# EAGLE design openSX70-dongle_v4-push (EAGLE 9.2.0)
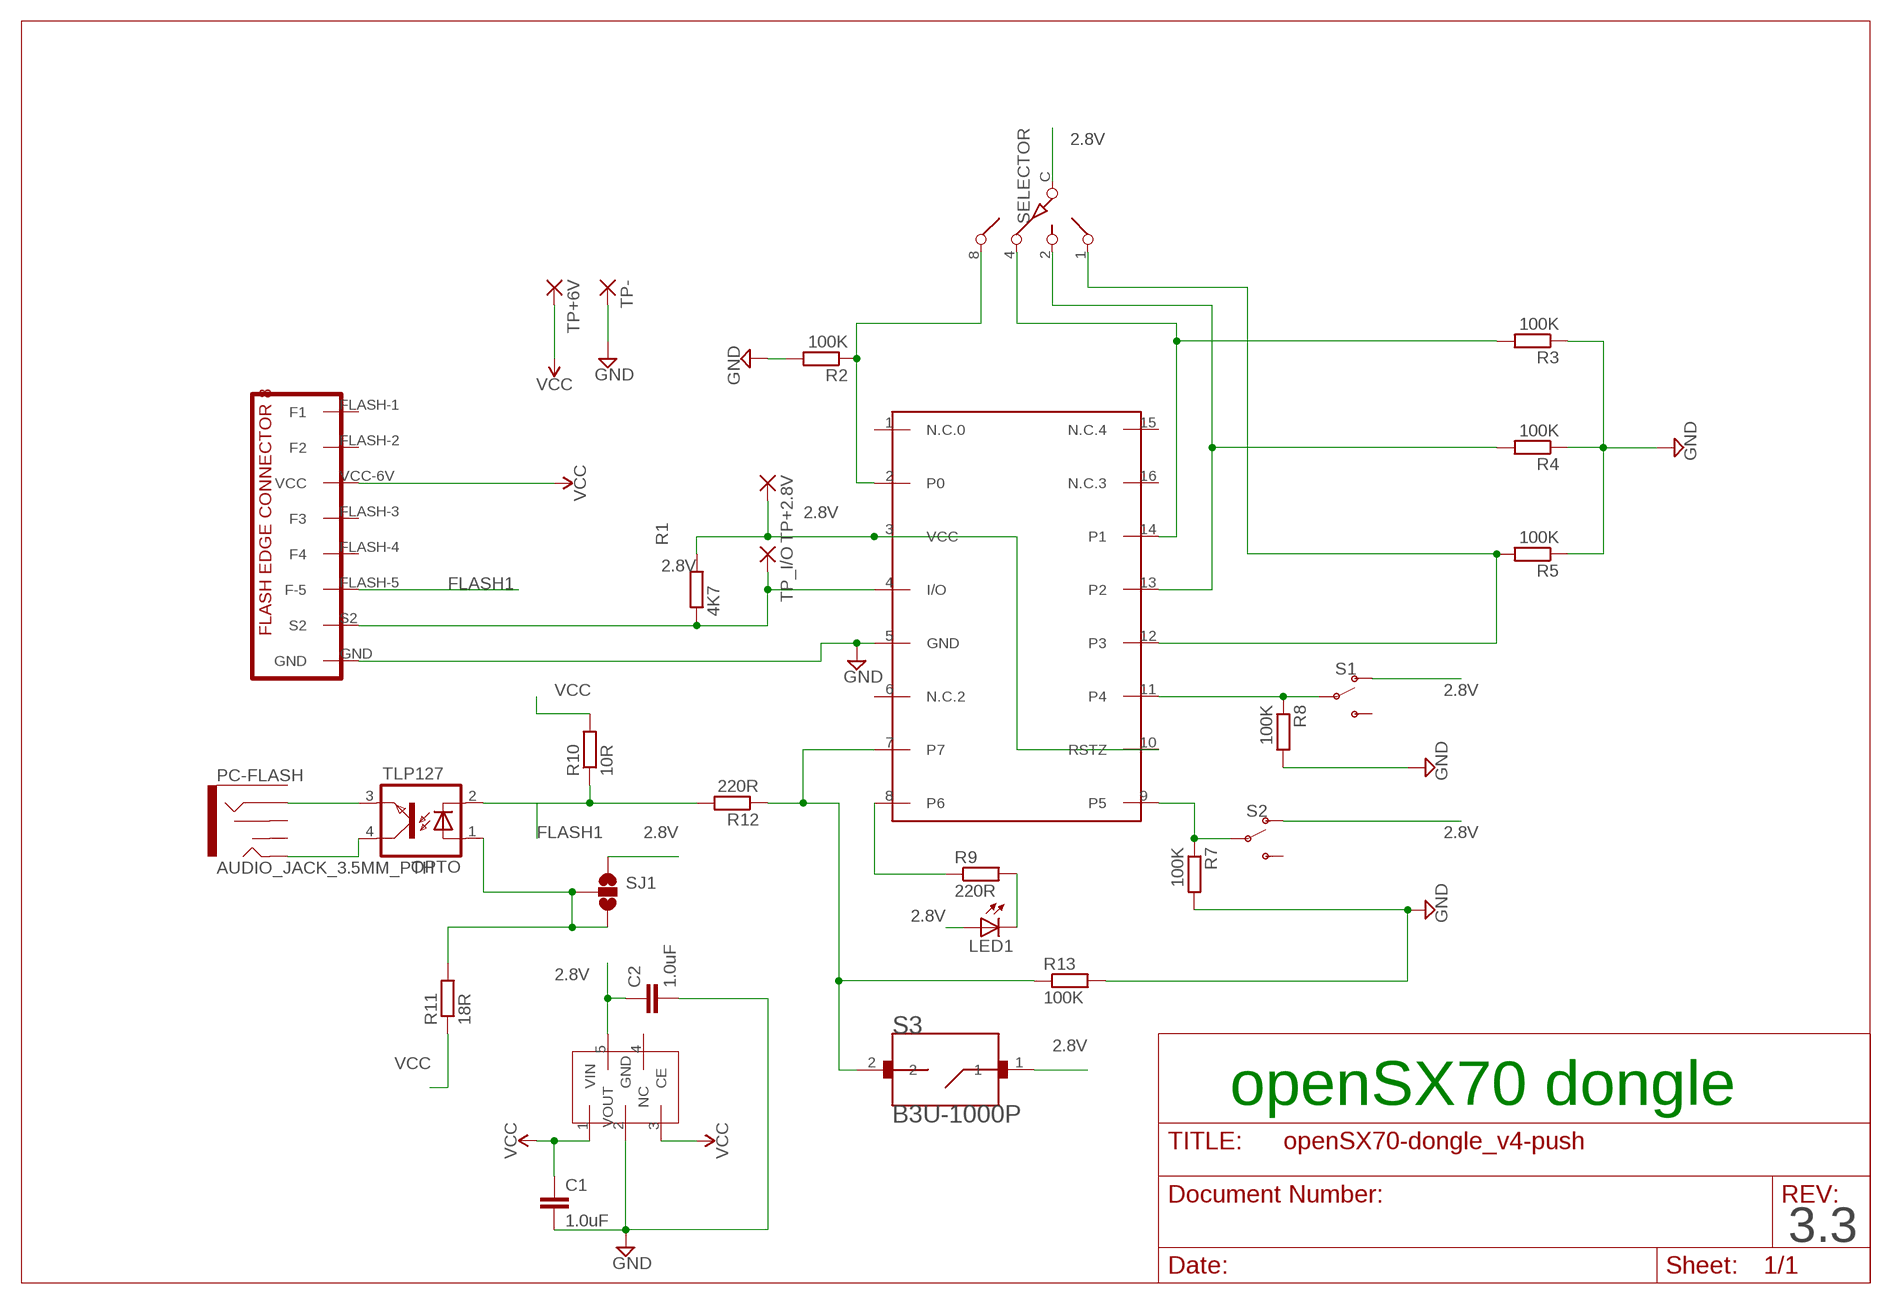
[diagram p0: schematic, sheet 1]

## Parts
C1  1.0uF  C-EUC0603  [C0603]
C2  1.0uF  C-EUC0603  [C0603]
DS2408  DS2408  [SO16]
LED1  LED3MM  [LED3MM]
OPTO  TLP127  [SO-4]
PC-FLASH  AUDIO_JACK_3.5MM_PTH  [AUDIO-JACK]
R1  4K7  R-EU_R0603  [R0603]
R2  100K  R-EU_R0603  [R0603]
R3  100K  R-EU_R0603  [R0603]
R4  100K  R-EU_R0603  [R0603]
R5  100K  R-EU_R0603  [R0603]
R7  100K  R-EU_R0603  [R0603]
R8  100K  R-EU_R0603  [R0603]
R9  220R  R-EU_R0603  [R0603]
R10  10R  R-EU_R0603  [R0603]
R11  18R  R-EU_R0603  [R0603]
R12  220R  R-EU_R0603  [R0603]
R13  100K  R-EU_R0603  [R0603]
REG  NCP4688  [SOT-23-5]
S1  SWITCH-SPDT-SMD-RIGHT-ANGLE  [SWITCH_SPST_SMD_A]
S2  SWITCH-SPDT-SMD-RIGHT-ANGLE  [SWITCH_SPST_SMD_A]
S3  B3U-1000P  [SW_B3U-1000P]
SELECTOR  SW-C16  [SW-C16]
SJ1  SOLDERJUMPER_2WAYS  [SJ_3]
TP+2.8V  SMD2  [SMD1,27-2,54]
TP+6V  SMD2  [SMD1,27-2,54]
TP-  SMD2  [SMD1,27-2,54]
TP_I/O  SMD2  [SMD1,27-2,54]
U$2  SX70-FLASH-EDGE8-MALE-PROPER  [SX70-FLASH-EDGE8]

## Nets
2.8V: C2.1 DS2408.3(VCC) DS2408.10(RSTZ) LED1.A R1.2 REG.5(VOUT) S1.1(O) S2.1(O) S3.1 SELECTOR.C SJ1.1 TP+2.8V.1(P)
FLASH1: OPTO.1(A) OPTO.2(C) R10.1 R11.2 R12.2 SJ1.2 SJ1.3 U$2.FLASH-5(F-5)
GND: C1.2 C2.2 DS2408.5(GND) R2.2 R3.1 R4.1 R5.1 R7.2 R8.2 R13.2 REG.2(GND) TP-.1(P) U$2.GND
N$1: DS2408.4(I/O) R1.1 TP_I/O.1(P) U$2.S2
N$2: LED1.K(C) R9.2
N$3: DS2408.2(P0) R2.1 SELECTOR.8
N$4: DS2408.14(P1) R3.2 SELECTOR.4
N$5: DS2408.13(P2) R4.2 SELECTOR.2
N$6: DS2408.11(P4) R8.1 S1.2(P)
N$7: DS2408.9(P5) R7.1 S2.2(P)
N$8: DS2408.8(P6) R9.1
N$9: DS2408.7 R12.1 R13.1 S3.2
N$12: OPTO.4(COL) PC-FLASH.TIP
N$13: DS2408.12(P3) R5.2 SELECTOR.1
N$15: OPTO.3(EMIT) PC-FLASH.RING
VCC: C1.1 R10.2 R11.1 REG.1(VIN) REG.3(CE) TP+6V.1(P) U$2.VCC-6V(VCC)
Unconnected: DS2408.1(N.C.0) DS2408.6(N.C.2) DS2408.15(N.C.4) DS2408.16(N.C.3) PC-FLASH.RSH PC-FLASH.SLEEVE PC-FLASH.TSH REG.4(NC) S1.3(S) S2.3(S) U$2.FLASH-1(F1) U$2.FLASH-2(F2) U$2.FLASH-3(F3) U$2.FLASH-4(F4)

## Notes on the sheet
- openSX70 dongle
- 3.3

## Library data of the parts
C1 C2 = rcl:C-EU: CAPACITOR, European symbol; SPICEPREFIX: C
DS2408 = DS2408-joaco:DS2408
LED1 = adafruit:LED: LED OSRAM: - CHIPLED LG R971, LG N971, LY N971, LG Q971, LY Q971, LO R971, LY R971 LH N974, LH R974 LS Q976, LO Q976, LY Q976 LO Q996 - Hyper CHIPLED LW Q18S LB Q993, LB Q99A, LB R99A - SideLED LS A670, LO A670, LY A670, LG A670, LP A670 LB A673, LV A673, LT A673, LW A673 LH A674 LY A675 LS A676, LA A676, LO A676, LY A676, LW A676 LS A679, LY A679, LG A679 - Hyper Micro SIDELED® LS Y876, LA Y876, LO Y876, LY Y876 LT Y87S - SmartLED LW L88C, LW L88S LB L89C, LB L89S, LG L890 LS L89K, LO L89K, LY L89K LS L896, LA L896, LO L896, LY L896 - TOPLED LS T670, LO T670, LY T670, LG T670, LP T670 LSG T670, LSP T670, LSY T670, LOP T670, LYG T670 LG T671, LOG T671, LSG T671 LB T673, LV T673, LT T673, LW T673 LH T674 LS T676, LA T676, LO T676, LY T676, LB T676, LH T676, LSB T676, LW T676 LB T67C, LV T67C, LT T67C, LS T67K, LO T67K, LY T67K, LW E67C LS E67B, LA E67B, LO E67B, LY E67B, LB E67C, LV E67C, LT E67C LW T67C LS T679, LY T679, LG T679 LS T770, LO T770, LY T770, LG T770, LP T770 LB T773, LV T773, LT T773, LW T773 LH T774 LS E675, LA E675, LY E675, LS T675 LS T776, LA T776, LO T776, LY T776, LB T776 LHGB T686 LT T68C, LB T68C - Hyper Mini TOPLED® LB M676 - Mini TOPLED Santana® LG M470 LS M47K, LO M47K, LY M47K Source: http://www.osram.convergy.de/
OPTO = openSX70:TLP127
PC-FLASH = SparkFun-Connectors:AUDIO_JACK_3.5MM: Audio Jack 3.5mm variants of PTH and SMT stereo audio jack with bypass switches. SparkFun Products: SparkFun SparkPunk Sound Kit <[https://www.sparkfun.com/products/11177]> - PTH MP3 Trigger <https://www.sparkfun.com/products/13720> -3.5mm SMD SparkFun PicoBoard <https://www.sparkfun.com/products/11888>- 2.5mm SMD; PROD_ID: CONN-08774; SF_ID: PRT-08032
R1-R5 R7-R9 R12 R13 = rcl:R-EU_: RESISTOR, European symbol; SPICEPREFIX: R
R10 R11 = resistor:R-EU_: RESISTOR, European symbol
REG = openSX70:NCP4688
S1 S2 = SparkFun-Switches:SWITCH-SPDT: Single Pole, Double Throw (SPDT) Switch Single-pole, double-throw (SPDT) switch. Variant Overview SMD-AYZ0202 Surface Mount DPDT Switch <https://www.sparkfun.com/products/597> (COM-00597) Used on e.g. LilyPad Arduino USB - ATmega32U4 Board <https://www.sparkfun.com/products/12049> PTH-11.6X4.0MM SPDT Mini Power Switch <https://www.sparkfun.com/products/102> (COM-00102) Used on e.g. SparkFun Simon Says - Through-Hole Soldering Kit <https://www.sparkfun.com/products/10547> (KIT-10547) PTH-11.6X4.0MM-KIT KIT version of SPDT Mini Power Switch - Simplifies soldering by removing tStop of switch pins - only one side can be soldered. PTH-11.6X4.0MM-LOCK LOCK version of SPDT Mini Power Switch - Offset pins hold switch in place for easier soldering. SMD-RIGHT-ANGLE Surface Mount Right Angle Switch <https://www.sparkfun.com/products/10860> (COM-10860) Used on e.g. SparkFun ESP8266 Thing <https://www.sparkfun.com/products/13231>; PROD_ID: SWCH-10651; SF_SKU: COM-10860
S3 = Common-Parts-Library-Eagle:B3U-1000P: Switch Tactile N.O. SPST Round Button Gull Wing 0.05A 12VDC 1.5N SMD Embossed T/R; MANUFACTURER: Omron
SELECTOR = special:SW-C16: SWITCH 16-step rotary switch
SJ1 = SparkFun-Passives:SOLDERJUMPER_2WAY: Solder Jumper 2 way solder jumper
TP+2.8V TP+6V TP- TP_I/O = wirepad:SMD2: SMD PAD
U$2 = _openSX70:SX70-FLASH-EDGE8-MALE-PROPER

## Net classes
0 GND: width 0.305 mm
1 VCC: width 0.254 mm
2 2.8V: width 0.254 mm

## Board
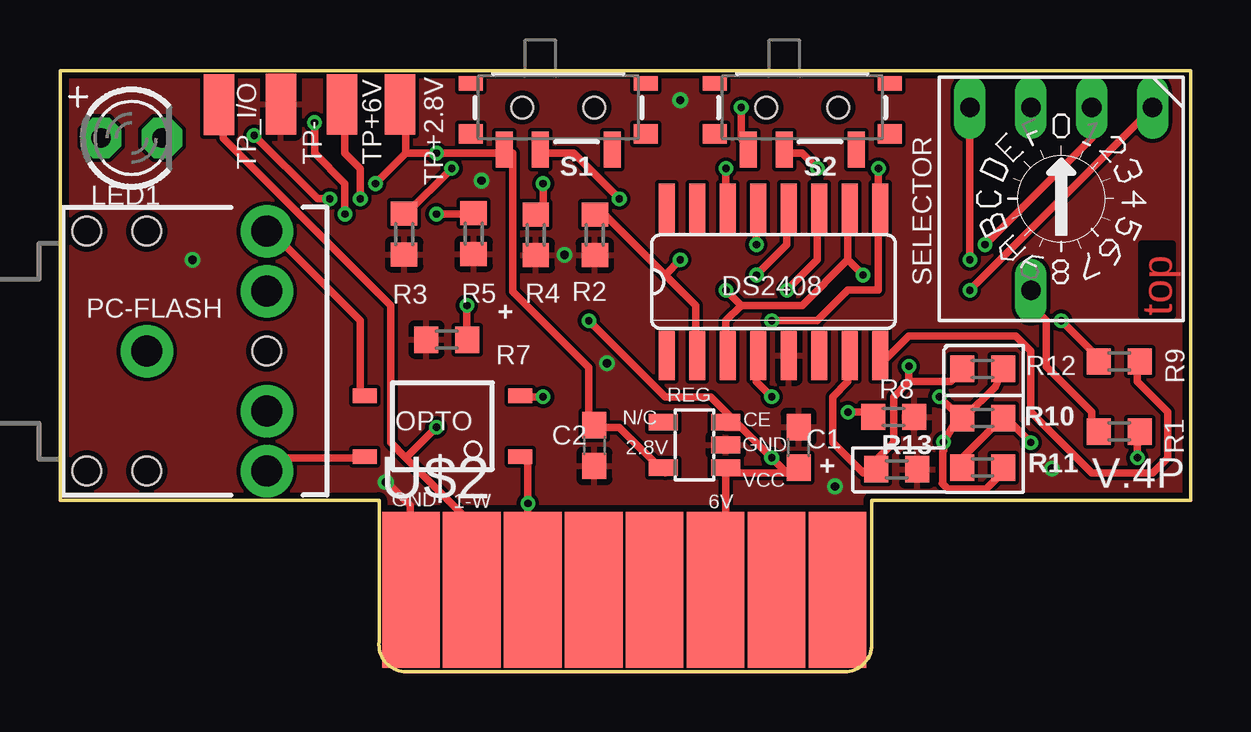
[diagram p1: board, top side]
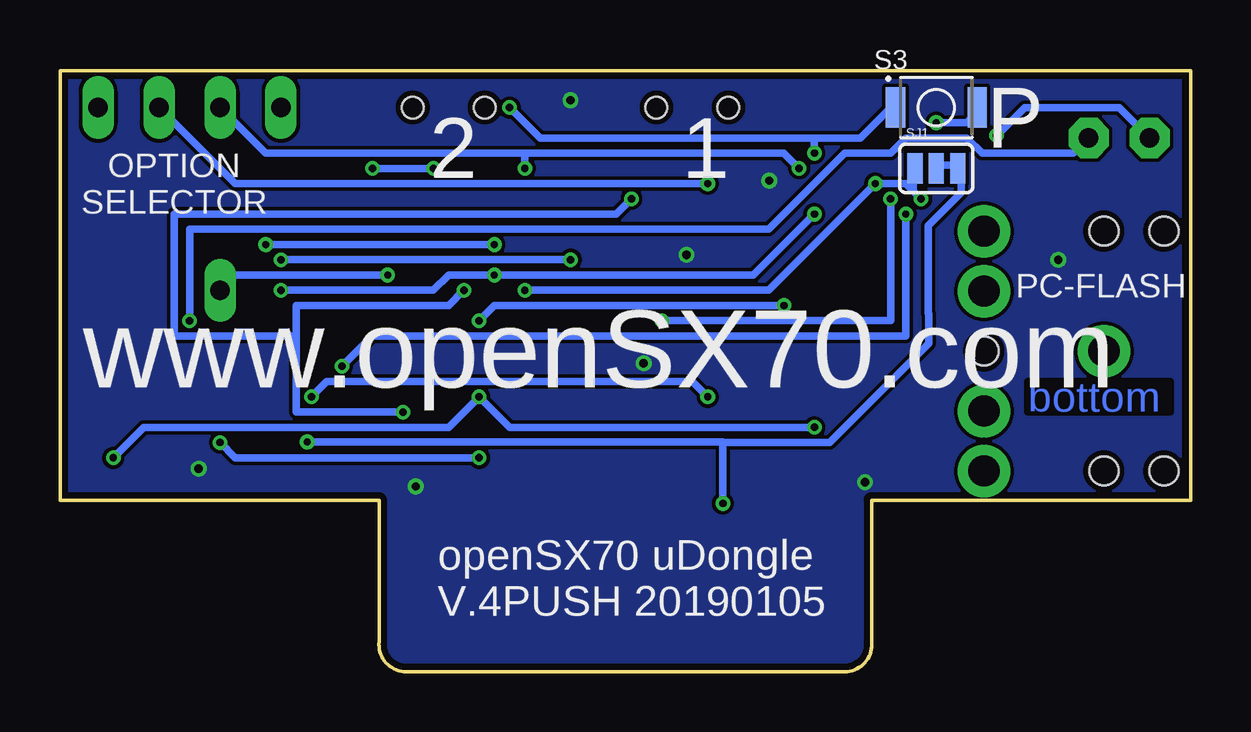
[diagram p2: board, bottom side, seen from below]

Size 47.12 x 25.04 mm. Coordinates in mm from the lower left corner, seen from the top.
Outline: 33.84,7.01 33.82,7.14
Outline: 33.82,7.14 33.82,1.24 arc-90 32.8,0 14.31,0 arc-90 13.3,1.24 13.3,7.14 0,7.14 0,25.04 47.12,25.04 47.12,7.14 33.82,7.14
Copper layers (1*16): Top 0.035mm / dielectric 1.5mm / Bottom 0.035mm
Design rules "SeeedStudio_2layer_DRU_no_angle_20140221": minimum track width 6mil, minimum drill 12mil, track to track 6mil, track to pad 6mil, pad to pad 6mil, via to via 6mil, smd to smd 0mil, copper to edge 10mil, drill to drill 10mil, minimum pad ring 10mil, minimum via ring 6mil, stop-mask expansion 2mil, vias tented up to drill 100mil, thermal gap 10mil

### Footprints (pad centres in the part's own frame; a part is rotated, then mirrored left to right if it is on the bottom)
C0603 = smd 1.1 x 1: 1 -0.85,0; 2 0.85,0
SO16 = smd 0.66 x 2.032: 1 -4.445,-3.073; 2 -3.175,-3.073; 3 -1.905,-3.073; 4 -0.635,-3.073; 5 0.635,-3.073; 6 1.905,-3.073; 7 3.175,-3.073; 8 4.445,-3.073; 9 4.445,3.073; 10 3.175,3.073; 11 1.905,3.073; 12 0.635,3.073; 13 -0.635,3.073; 14 -1.905,3.073; 15 -3.175,3.073; 16 -4.445,3.073
LED3MM = drill 0.813 pad 1.676 octagon: A -1.27,0; K 1.27,0
SO-4 = smd 1 x 0.6: 1 -3.24,0.635; 2 -3.24,-1.905; 3 3.24,-1.905; 4 3.24,0.635
AUDIO-JACK = drill 1.3 pad 2.184: RING 5,5; RSH 5,2.5; SLEEVE 0,0; TIP 5,-5; TSH 5,-2.5 | hole 1.2: 0,5; -2.5,5; -2.5,-5; 0,-5; 5,0
R0603 = smd 1 x 1.1: 1 -0.85,0; 2 0.85,0
SOT-23-5 = smd 0.69 x 1.2: 1 -0.95,-1.3; 2 0,-1.3; 3 0.95,-1.3; 4 0.95,1.3; 5 -0.95,1.3
SWITCH_SPST_SMD_A = smd 0.7 x 1.5: 1 -2.25,-1.75; 2 -0.75,-1.75; 3 2.25,-1.75 | smd 1 x 0.6: GND1 -3.65,1; GND3 3.65,1 | smd 1 x 0.8: GND2 -3.65,-1.1; GND4 3.65,-1.1 | hole 0.9: -1.5,0; 1.5,0
SW_B3U-1000P = smd 0.8 x 1.7: 1 -1.7,0; 2 1.7,0
SW-C16 = drill 0.813 long: 1 -3.81,-3.81; 2 -1.27,-3.81; 4 1.27,-3.81; 8 3.81,-3.81; C 1.27,3.81
SJ_3 = smd 0.635 x 1.27: 1 -0.889,0; 2 0,0; 3 0.889,0
SMD1,27-2,54 = smd 1.27 x 2.54: 1 0,0
SX70-FLASH-EDGE8 = smd 2.4 x 6.502: FLASH-1 8.89,0.001; FLASH-2 6.35,0.001; FLASH-3 1.27,0.001; FLASH-4 -1.27,0.001; FLASH-5 -3.81,0.001; GND -8.89,0.001; S2 -6.35,0.001; VCC-6V 3.81,0.001

### Placement (x,y rotation side)
C1  30.77,9.35 90 top
C2  22.26,9.42 270 top
DS2408  29.73,16.26 0 top
LED1  2.98,22.25 0 top
OPTO  15.93,9.6 180 top
PC-FLASH  3.62,13.36 0 top
R1  44.13,10.01 180 top
R2  22.29,18.21 270 top
R3  14.34,18.24 90 top
R4  19.82,18.21 90 top
R5  17.23,18.26 90 top
R7  16.12,13.84 180 top
R8  34.73,10.62 0 top
R9  44.13,12.93 180 top
R10  38.44,10.57 0 top
R11  38.44,8.51 0 top
R12  38.44,12.62 0 top
R13  34.86,8.43 0 top
REG  26.44,9.45 90 top
S1  20.76,23.52 0 top
S2  30.92,23.52 0 top
S3  10.6,23.52 0 bottom
SELECTOR  41.72,19.71 180 top
SJ1  10.6,20.98 0 bottom
TP+2.8V  14.16,23.65 0 top
TP+6V  11.75,23.65 0 top
TP-  9.21,23.66 0 top
TP_I/O  6.63,23.63 0 top
U$2  23.51,3.4 0 top

### Tracks (layer width: path | path; a pad name or v marks a point on that pad's centre or on a via)
2.8V  (via drill 0.3)
  Top 0.305: SELECTOR.C 40.45,15.27 41.08,14.63 41.08,12.73 42.99,10.82 42.99,10.19 R1.2 | 28.38,15.27 27.75,14.63 27.75,13.36 DS2408.3 | 28.38,15.27 30.92,15.27 32.83,17.17 | 32.83,17.17 32.83,19.08 DS2408.10 | 32.83,17.17 v33.46,16.54 | v28.38,23.52 28.38,22.25 S2.1 | REG.5 25.21,8.28 23.3,10.19 22.67,10.19 C2.1 22.03,10.82 22.03,12.67 18.86,15.85 18.86,21.62 S1.1 18.22,21.62 v15.68,21.62 14.41,21.62 | 14.41,21.62 v13.14,20.35 | 14.41,21.62 14.41,23.52 TP+2.8V.1 | v8.09,22.35 10.73,19.71 v11.24,19.71 | v27.75,15.9 28.38,15.27
  Bottom 0.305: SELECTOR.C 39.81,16.54 v33.46,16.54 | v28.38,23.52 27.11,22.25 15.68,22.25 | 15.68,22.25 13.78,22.25 12.51,23.52 S3.1 | LED1.A 2.98,23.52 6.92,23.52 v8.09,22.35 | 11.56,20.03 11.87,20.35 v13.14,20.35 17.59,15.9 v27.75,15.9 | 11.56,20.03 v11.24,19.71 | v15.68,21.62 15.68,22.25 | SJ1.1 11.56,20.92 11.56,20.03
FLASH1  (via drill 0.3)
  Top 0.305: v20.13,11.46 19.49,11.46 OPTO.2 | v36.64,11.46 37.27,10.82 37.33,10.82 R10.1 | R12.2 38.96,11.88 37.73,10.64 R10.1 | OPTO.1 19.39,8.99 19.49,8.92 v19.49,7.01 19.49,3.84 19.39,3.73 19.62,3.51 U$2.FLASH-5 | R10.1 37.41,10.57 v36.82,9.58 36.82,9.21 36.79,9.19 36.79,7.87 36.77,7.85 37,7.62 38.6,7.62 39.28,8.31 R11.2
  Bottom 0.305: 19.49,9.55 15.05,9.55 10.92,13.68 10.92,14.92 10.93,14.94 10.93,18.59 9.56,19.96 9.56,20.88 SJ1.3 9.79,21.11 10.48,21.11 SJ1.2 | v36.82,9.58 19.49,9.58 19.49,9.55 | 19.49,9.55 v19.49,7.01 | v20.13,11.46 20.76,12.09 36,12.09 v36.64,11.46
GND  (via drill 0.35)
  Top 0.305: U$2.GND 14.59,3.51 14.59,6.93 13.68,7.85 v13.58,7.9
  other vias: 5.52,17.17 32.3,7.72 41.34,8.46 21.02,17.37 22.8,12.85 17.56,20.47 25.84,23.83
  pour Top: 0.44,24.79 47.43,24.79 47.43,7.01 0.44,7.01
  pour Bottom: 0.44,24.79 0.44,7.01 13.14,7.01 13.14,0.36 33.46,0.36 33.46,7.01 47.43,7.01 47.43,24.79
N$1  (via drill 0.3)
  Top 0.305: v44.89,8.92 44.89,9.55 R1.1 | v29.65,11.46 29.02,12.09 29.02,12.73 DS2408.4 | 14.41,8.92 16.95,6.38 16.95,3.84 16.88,3.73 17.11,3.51 U$2.S2 | 14.41,8.92 13.78,9.55 13.78,15.27 6.79,22.25 6.79,23.52 TP_I/O.1 | 14.41,8.92 v15.68,10.19
  Bottom 0.305: v44.89,8.92 43.62,10.19 30.92,10.19 v29.65,11.46 28.38,10.19 v15.68,10.19
N$2  (via drill 0.3)
  Top 0.305: v41.72,14.63 42.99,13.36 R9.2
  Bottom 0.305: v41.72,14.63 41.72,18.44 17.59,18.44 14.41,21.62 12.51,21.62 11.87,22.25 9.33,22.25 8.7,21.62 4.89,21.62 LED1.K
N$3  (via drill 0.3)
  Top 0.305: 25.21,16.54 26.48,15.27 26.48,13.36 DS2408.2 | 25.21,16.54 22.67,19.08 R2.1 | v37.91,17.17 SELECTOR.8 | 25.21,16.54 v25.84,17.17
  Bottom 0.305: v25.84,17.17 v37.91,17.17
N$4  (via drill 0.3)
  Top 0.305: v16.32,20.98 14.41,19.08 R3.2 | v27.75,20.98 27.75,19.71 DS2408.14
  Bottom 0.305: v16.32,20.98 16.95,21.62 27.75,21.62 | 27.75,21.62 38.54,21.62 SELECTOR.4 | 27.75,21.62 v27.75,20.98
N$5  (via drill 0.3)
  Top 0.305: v20.13,20.35 20.13,19.08 R4.2 | v29.02,17.81 29.02,19.08 DS2408.13 | v38.54,17.81 42.99,22.25 SELECTOR.2
  Bottom 0.305: v20.13,20.35 39.81,20.35 SELECTOR.2 | v38.54,17.81 v29.02,17.81
N$6  (via drill 0.3)
  Top 0.305: v32.83,10.82 33.46,10.82 R8.1 | v30.29,15.9 31.56,17.17 31.56,19.08 DS2408.11 | v23.3,19.71 21.4,21.62 20.13,21.62 S1.2
  Bottom 0.305: v32.83,10.82 37.27,10.82 37.27,14 | 37.27,14 37.27,15.27 30.92,15.27 v30.29,15.9 | v23.3,19.71 23.94,19.08 42.35,19.08 42.35,14 37.27,14
N$7  (via drill 0.3)
  Top 0.305: v16.95,15.27 16.95,14 R7.1 | v29.65,14.63 31.56,14.63 32.83,15.9 34.1,15.9 34.1,19.08 DS2408.9 34.1,19.71 v34.1,20.98 | v31.56,20.98 30.92,21.62 30.29,21.62 S2.2
  Bottom 0.305: v16.95,15.27 29.02,15.27 v29.65,14.63 | v34.1,20.98 v31.56,20.98
N$8
  Top 0.305: R9.1 44.89,12.73 44.89,12.09 46.16,10.82 46.16,8.92 45.53,8.28 42.99,8.28 40.45,10.82 40.45,13.36 39.81,14 35.37,14 34.1,12.73 DS2408.8
N$9  (via drill 0.3)
  Top 0.305: DS2408.7 32.83,12.73 32.83,12.09 32.19,11.46 32.19,9.55 33.46,8.28 33.76,8.57 | 35.37,12.09 37.11,12.09 R12.1 | 35.37,12.09 34.73,11.46 34.73,9.55 33.76,8.57 | v10.6,22.89 10.6,21.62 11.87,20.35 v11.87,19.08 | 35.37,12.09 v35.37,12.73 | R13.1 33.79,8.53 33.76,8.57
  Bottom 0.305: v10.6,22.89 9.33,22.89 8.7,23.52 S3.2 | v11.87,19.08 11.87,14 34.1,14 v35.37,12.73
N$12
  Top 0.305: OPTO.4 12.51,8.92 8.7,8.92 PC-FLASH.TIP
N$13  (via drill 0.3)
  Top 0.305: v15.68,19.08 16.95,19.08 R5.2 | v29.02,16.54 30.29,17.81 30.29,19.08 DS2408.12 | v37.91,15.9 SELECTOR.1
  Bottom 0.305: v15.68,19.08 18.22,16.54 v29.02,16.54 30.92,16.54 31.56,15.9 v37.91,15.9
N$15
  Top 0.305: OPTO.3 12.51,11.46 12.51,14.63 8.7,18.44 PC-FLASH.RING
VCC  (via drill 0.3)
  Top 0.305: R10.2 39.18,10.45 | 27.75,8.28 30.29,8.28 | 28.38,10.19 27.75,10.19 REG.3 | 30.29,8.28 v29.65,8.92 28.38,10.19 | 30.29,8.28 C1.1 | v40.45,9.55 39.6,10.4 R10.2 | v12.51,19.71 12.51,20.98 11.87,21.62 11.87,23.52 TP+6V.1 | v22.03,14.63 25.21,11.46 27.11,11.46 28.38,10.19 | 27.75,8.28 27.75,3.96 | 27.75,3.96 27.75,3.84 | 27.75,8.28 REG.1 | R11.1 37.68,8.53 37.68,8.99 39.05,10.36 R10.2 | U$2.VCC-6V 27.39,3.51 27.85,3.96 27.75,3.96
  Bottom 0.305: v40.45,9.55 39.81,8.92 v29.65,8.92 | v12.51,19.71 12.51,14.63 v22.03,14.63

### Text on the board
Top: top
Bottom: bottom
tPlace: + | + | V.4P
bPlace: www.openSX70.com
tNames: N/C | CE | 2.8V | GND | VCC | GND | 1-W | 6V
bNames: P | 1 | 2 | OPTION / SELECTOR | PC-FLASH | openSX70 uDongle / V.4PUSH 20190105